# Altium project CC_SOC DEBUGGER.PrjPcb
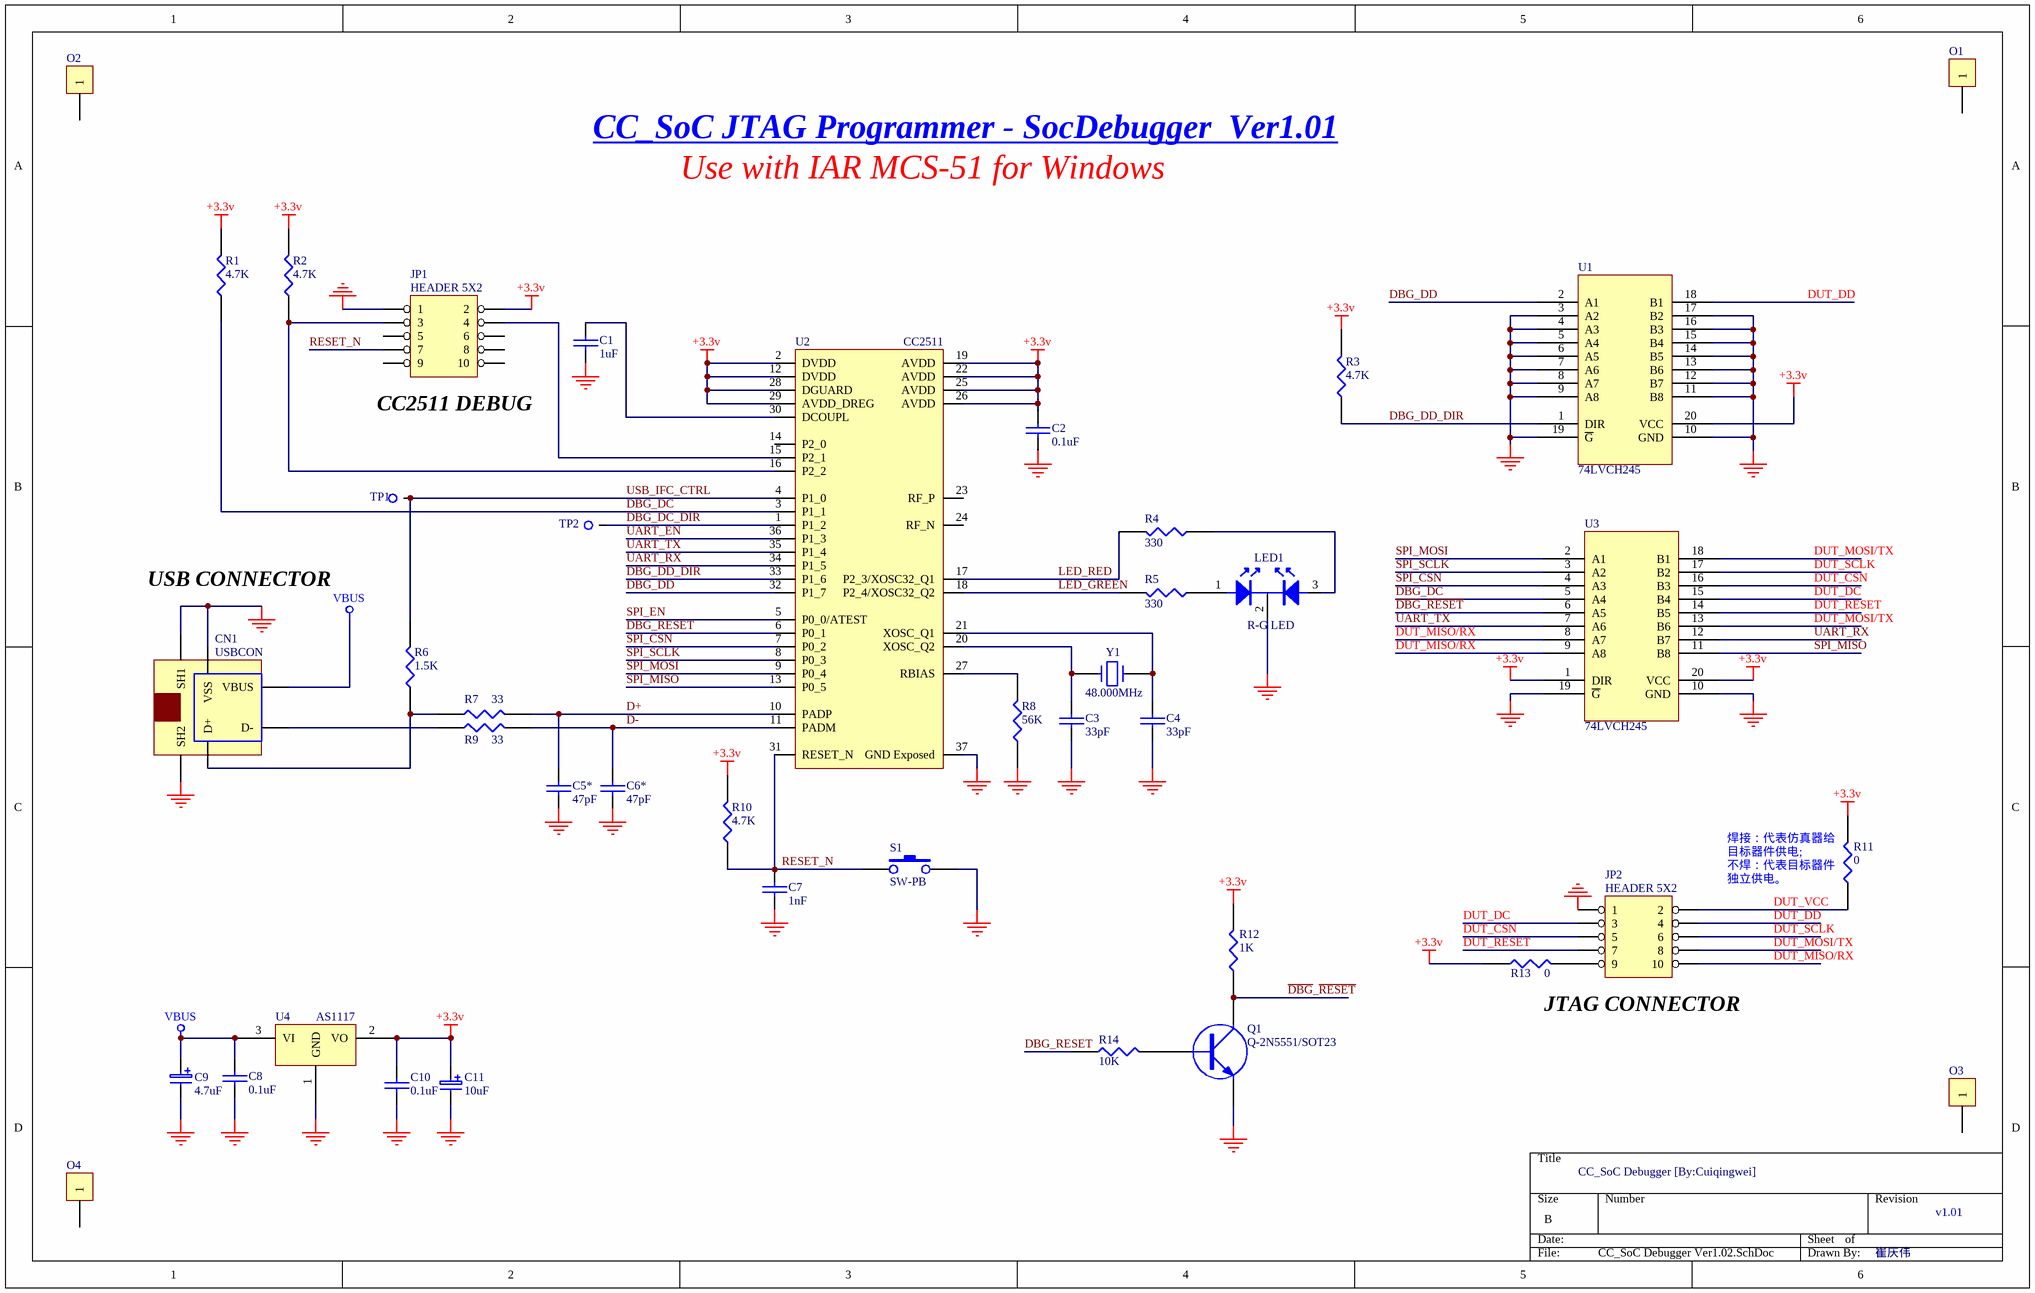
[diagram p0: CC_SoC Debugger Ver1.02.SchDoc]
1 sheet, 42 parts. Net scope: global (net labels, ports and power ports of the same name join across sheets).
Board file: CC_SoC Debugger Ver1.02.PcbDoc

## Sheet CC_SoC Debugger Ver1.02.SchDoc
size B; SheetNumber: 0; SheetTotal: 0

### Parts
C1  1uF  [0805]
C2  0.1uF  [0805]
C3  33pF  [0805]
C4  33pF  [0805]
C5*  47pF  [0805]
C6*  47pF  [0805]
C7  1nF  [0805]
C8  0.1uF  [0805]
C9  4.7uF  [1206]
C10  0.1uF  [0805]
C11  10uF  [1206]
CN1  USBCON  [USB-B]
JP1  HEADER 5X2  [HDR5X2-LP]
JP2  HEADER 5X2  [FKV10LN]
LED1  R-G LED  [LED-05/KC/C]
O1  (no value)  [HOLE3_1]
O2  (no value)  [HOLE3_1]
O3  (no value)  [HOLE3_1]
O4  (no value)  [HOLE3_1]
Q1  Q-2N5551/SOT23  [sot23]
R1  4.7K  [0805]
R2  4.7K  [0805]
R3  4.7K  [0805]
R4  330  [0805]
R5  330  [0805]
R6  1.5K  [0805]
R7  33  [0805]
R8  56K  [0805]
R9  33  [0805]
R10  4.7K  [0805]
R11  0  [0805]
R12  1K  [0805]
R13  0  [0805]
R14  10K  [0805]
S1  SW-PB  [B3F-31XX]
TP1  TP1  [TESTPOINT-PAD35]  (value not drawn)
TP2  TP3  [TESTPOINT-PAD35]  (value not drawn)
U1  74LVCH245  [SO20/1.27/9.652]
U2  CC2511  [CC2511]
U3  74LVCH245  [SO20/1.27/9.652]
U4  AS1117  [SOT-223]
Y1  48.000MHz  [XTAL-6X3.5]

### Nets
+3.3v: C2.1 C10.1 C11.1(+) JP1.2 R1.2 R2.2 R3.2 R10.2 R11.2 R12.2 R13.1 U1.20(VCC) U2.2(DVDD) U2.12(DVDD) U2.19(AVDD) U2.22(AVDD) U2.25(AVDD) U2.26(AVDD) U2.28(DGUARD) U2.29(AVDD_DREG) U3.1(DIR) U3.20(VCC) U4.2(VO)
GND: C1.2 C2.2 C3.2 C4.2 C5*.2 C6*.2 C7.2 C8.2 C9.2(-) C10.2 C11.2(-) CN1.SH1 CN1.SH2 CN1.VSS JP1.1 JP2.1 LED1.2(K) Q1.2(E) R8.1 S1.2 U1.3(A2) U1.4(A3) U1.5(A4) U1.6(A5) U1.7(A6) U1.8(A7) U1.9(A8) U1.10(GND) U1.11(B8) U1.12(B7) U1.13(B6) U1.14(B5) U1.15(B4) U1.16(B3) U1.17(B2) U1.19(~{G}) U2.37(GND_Exposed) U3.10(GND) U3.19(~{G}) U4.1(GND)
VBUS: C8.1 C9.1(+) CN1.VBUS U4.3(VI)
D+: C5*.1 R7.2 U2.10(PADP)
D-: C6*.1 R9.2 U2.11(PADM)
~{DBG}_~{RESET}: Q1.3(C) R12.1 U3.6(A5)
DBG_DC: R1.1 U2.3(P1_1) U3.5(A4)
DBG_DC_DIR: TP2.1 U2.1(P1_2)
DBG_DD: U1.2(A1) U2.32(P1_7)
DBG_DD_DIR: R3.1 U1.1(DIR) U2.33(P1_6)
DBG_RESET: R14.1 U2.6(P0_1)
DUT_CSN: JP2.5 U3.16(B3)
DUT_DC: JP2.3 U3.15(B4)
DUT_DD: JP2.4 U1.18(B1)
DUT_MISO/RX: JP2.10 U3.8(A7) U3.9(A8)
DUT_MOSI/TX: JP2.8 U3.13(B6) U3.18(B1)
DUT_RESET: JP2.7 U3.14(B5)
DUT_SCLK: JP2.6 U3.17(B2)
DUT_VCC: JP2.2 R11.1
LED_GREEN: R5.2 U2.18(P2_4/XOSC32_Q2)
LED_RED: R4.2 U2.17(P2_3/XOSC32_Q1)
RESET_N: C7.1 JP1.7 R10.1 S1.1 U2.31(RESET_N)
SPI_CSN: U2.7(P0_2) U3.4(A3)
SPI_EN: U2.5(P0_0/ATEST)
SPI_MISO: U2.13(P0_5) U3.11(B8)
SPI_MOSI: U2.9(P0_4) U3.2(A1)
SPI_SCLK: U2.8(P0_3) U3.3(A2)
UART_EN: U2.36(P1_3)
UART_RX: U2.34(P1_5) U3.12(B7)
UART_TX: U2.35(P1_4) U3.7(A6)
USB_IFC_CTRL: R6.2 TP1.1 U2.4(P1_0)
NetC1_1: C1.1 U2.30(DCOUPL)
NetC3_1: C3.1 U2.20(XOSC_Q2) Y1.1
NetC4_1: C4.1 U2.21(XOSC_Q1) Y1.3
NetCN1_D+: CN1.D+ R6.1 R7.1
NetCN1_D-: CN1.D- R9.1
NetJP1_3: JP1.3 R2.1 U2.16(P2_2)
NetJP1_4: JP1.4 U2.15(P2_1)
NetJP2_9: JP2.9 R13.2
NetLED1_1: LED1.1(A) R5.1
NetLED1_3: LED1.3(A) R4.1
NetQ1_1: Q1.1(B) R14.2
NetR8_2: R8.2 U2.27(RBIAS)

Not connected (* = marked no-connect by the designer): JP1 5 6 8 9 10; O1 1; O2 1; O3 1; O4 1; U2 14(P2_0) 23(RF_P) 24(RF_N)

### Notes on the sheet
- CC_SoC JTAG Programmer - SocDebugger  Ver1.01
- Use with IAR MCS-51 for Windows
- (near JP1) CC2511 DEBUG
- USB CONNECTOR
- (near R11) 焊接：代表仿真器给目标器件供电;
  不焊：代表目标器件独立供电。
- JTAG CONNECTOR
- CC_SoC Debugger [By:Cuiqingwei]
- 崔庆伟
- Labels drawn without touching a wire or pin: v1.01

### Library data of the parts
C1-C4 C5* C6* C7 C8 C10 = CAP: Capacitor
C9 C11 = C2
CN1 = USBCON: Connector
LED1 = LED-05/KC/COMMON_K: 312; Text Field1: LED/R-G/10/H/630-560/05/KC/C; Text Field3: red-green; PartNumber: *; PartDesc: *; Value: *; Tolerance: *
O1-O4 = CON1: Connector
Q1 = Q-2N5551/SOT23: 311000001; Text Field1: Q-2N5551/SOT23/PHILIPS; Text Field2: 2N5551/NPN/SOT23; PartNumber: *; PartDesc: *; Value: *; Tolerance: *
R1-R14 = RES1
TP1 TP2 = TP
U1 U3 = 74LVCH245: 313; PartNumber: *; PartDesc: *; Value: *; Tolerance: *
Y1 = XTAL_SMD_4X2_5(4.0_X_2.5_MM)